# Altium schematic sheet Audio.SchDoc
size A4; Revision: B.2(PCB.SCH)
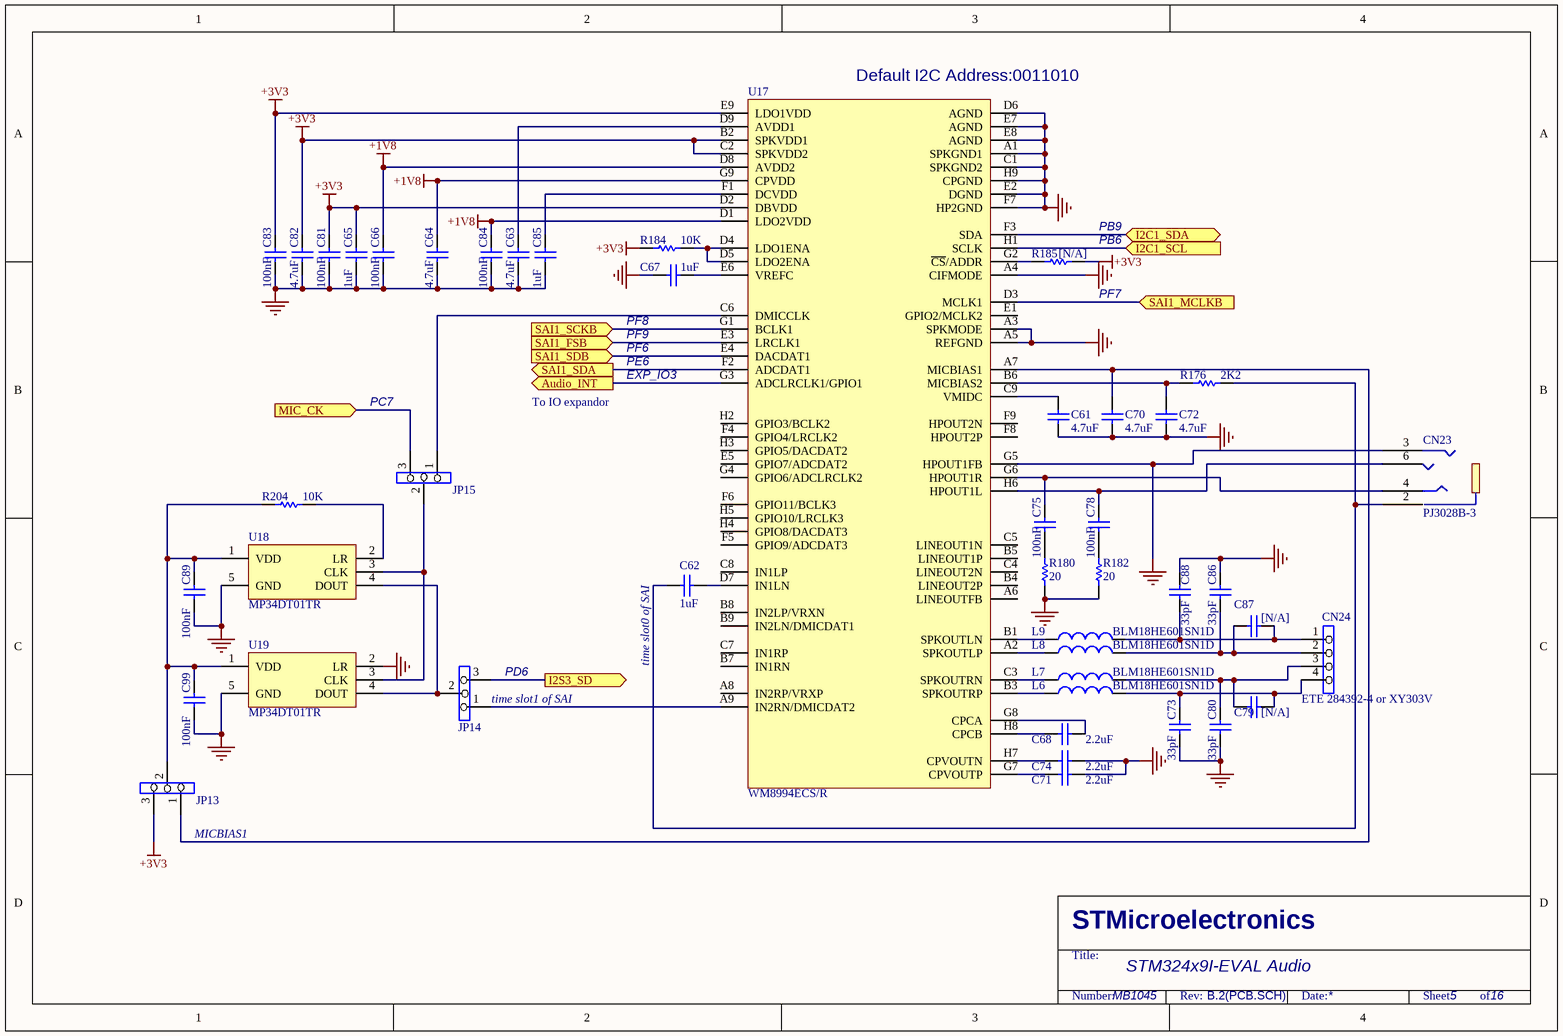
[diagram p0: Audio.SchDoc]

## Parts
C61  4.7uF  [0603C]
C62  1uF  [0603C]
C63  4.7uF  [0603C]
C64  4.7uF  [0603C]
C65  1uF  [0603C]
C66  100nF  [0603C]
C67  1uF  [0603C]
C68  2.2uF  [0603C]
C70  4.7uF  [0603C]
C71  2.2uF  [0603C]
C72  4.7uF  [0603C]
C73  33pF  [0603C]
C74  2.2uF  [0603C]
C75  100nF  [0603C]
C78  100nF  [0603C]
C79  [N/A]  [0603C]
C80  33pF  [0603C]
C81  100nF  [0603C]
C82  4.7uF  [0603C]
C83  100nF  [0603C]
C84  100nF  [0603C]
C85  1uF  [0603C]
C86  33pF  [0603C]
C87  [N/A]  [0603C]
C88  33pF  [0603C]
C89  100nF  [0603C]
C99  100nF  [0603C]
CN23  PJ3028B-3  [PJ3028B]
CN24  ETE 284392-4 or XY303V  [BUCHANAN_284392-4]
JP13  (no value)  [SIP3]
JP14  (no value)  [SIP3]
JP15  (no value)  [SIP3]
L6  BLM18HE601SN1D  [0603L]
L7  BLM18HE601SN1D  [0603L]
L8  BLM18HE601SN1D  [0603L]
L9  BLM18HE601SN1D  [0603L]
R176  2K2  [0603R]
R180  20  [0603R]
R182  20  [0603R]
R184  10K  [0603R]
R185  [N/A]  [0603R]
R204  10K  [0603R]
U17  WM8994ECS/R  [BGA72_0R5_4R5X4]
U18  MP34DT01TR  [MP34DT01TR]
U19  MP34DT01TR  [MP34DT01TR]

## Ports
Audio_INT (out), I2C1_SCL (in), I2C1_SDA (bidir), I2S3_SD (out), MIC_CK (in), SAI1_FSB (in), SAI1_MCLKB (in), SAI1_SCKB (in), SAI1_SDA (out), SAI1_SDB (in)

## Nets
+1V8: C64.1 C66.1 C84.1 U17.D1(LDO2VDD) U17.D8(AVDD2) U17.G9(CPVDD)
+3V3: C65.1 C81.1 C82.1 C83.1 JP13.3 R184.2 R185.1 U17.B2(SPKVDD1) U17.C2(SPKVDD2) U17.D2(DBVDD) U17.E9(LDO1VDD)
GND: C61.1 C63.2 C64.2 C65.2 C66.2 C67.2 C70.1 C71.2 C72.1 C73.2 C74.2 C80.2 C81.2 C82.2 C83.2 C84.2 C85.2 C86.1 C88.1 C89.2 C99.2 CN23.3 R180.2 R182.2 U17.A1(SPKGND1) U17.A3(SPKMODE) U17.A4(CIFMODE) U17.A5(REFGND) U17.C1(SPKGND2) U17.D6(AGND) U17.E2(DGND) U17.E7(AGND) U17.E8(AGND) U17.F7(HP2GND) U17.G5(HPOUT1FB) U17.H9(CPGND) U18.5(GND) U19.2(LR) U19.5(GND)
Audio_INT: U17.G3(ADCLRCLK1/GPIO1) ; port Audio_INT
I2C1_SCL: U17.H1(SCLK) ; port I2C1_SCL
I2C1_SDA: U17.F3(SDA) ; port I2C1_SDA
I2S3_SD: JP14.3 ; port I2S3_SD
MIC_CK: JP15.3 ; port MIC_CK
SAI1_FSB: U17.E3(LRCLK1) ; port SAI1_FSB
SAI1_MCLKB: U17.D3(MCLK1) ; port SAI1_MCLKB
SAI1_SCKB: U17.G1(BCLK1) ; port SAI1_SCKB
SAI1_SDA: U17.F2(ADCDAT1) ; port SAI1_SDA
SAI1_SDB: U17.E4(DACDAT1) ; port SAI1_SDB
NetC61_2: C61.2 U17.C9(VMIDC)
NetC62_1: C62.1 U17.D7(IN1LN)
NetC62_2: C62.2 CN23.2 R176.1
NetC63_1: C63.1 U17.D9(AVDD1)
NetC67_1: C67.1 U17.E6(VREFC)
NetC68_1: C68.1 U17.H8(CPCB)
NetC68_2: C68.2 U17.G8(CPCA)
NetC70_2: C70.2 JP13.1 U17.A7(MICBIAS1)
NetC71_1: C71.1 U17.G7(CPVOUTP)
NetC72_2: C72.2 R176.2 U17.B6(MICBIAS2)
NetC73_1: C73.1 C79.2 CN24.4 L6.2
NetC74_1: C74.1 U17.H7(CPVOUTN)
NetC75_1: C75.1 CN23.4 U17.G6(HPOUT1R)
NetC75_2: C75.2 R180.1
NetC78_1: C78.1 CN23.6 U17.H6(HPOUT1L)
NetC78_2: C78.2 R182.1
NetC79_1: C79.1 C80.1 CN24.3 L7.2
NetC85_1: C85.1 U17.F1(DCVDD)
NetC86_2: C86.2 C87.1 CN24.2 L8.2
NetC87_2: C87.2 C88.2 CN24.1 L9.2
NetC89_1: C89.1 C99.1 JP13.2 R204.2 U18.1(VDD) U19.1(VDD)
NetJP14_1: JP14.1 U17.A9(IN2RN/DMICDAT2)
NetJP14_2: JP14.2 U18.4(DOUT) U19.4(DOUT)
NetJP15_1: JP15.1 U17.C6(DMICCLK)
NetJP15_2: JP15.2 U18.3(CLK) U19.3(CLK)
NetL6_1: L6.1 U17.B3(SPKOUTRP)
NetL7_1: L7.1 U17.C3(SPKOUTRN)
NetL8_1: L8.1 U17.A2(SPKOUTLP)
NetL9_1: L9.1 U17.B1(SPKOUTLN)
NetR184_1: R184.1 U17.D4(LDO1ENA) U17.D5(LDO2ENA)
NetR185_2: R185.2 U17.G2(~{CS}/ADDR)
NetR204_1: R204.1 U18.2(LR)

Not connected (* = marked no-connect by the designer): U17 A6(LINEOUTFB) A8(IN2RP/VRXP) B4(LINEOUT2P) B5(LINEOUT1P) B7(IN1RN) B8(IN2LP/VRXN) B9(IN2LN/DMICDAT1) C4(LINEOUT2N) C5(LINEOUT1N) C7(IN1RP) C8(IN1LP) E1(GPIO2/MCLK2) E5(GPIO7/ADCDAT2) F4(GPIO4/LRCLK2) F5(GPIO9/ADCDAT3) F6(GPIO11/BCLK3) F8(HPOUT2P) F9(HPOUT2N) G4(GPIO6/ADCLRCLK2) H2(GPIO3/BCLK2) H3(GPIO5/DACDAT2) H4(GPIO8/DACDAT3) H5(GPIO10/LRCLK3)

## Notes on the sheet
- (near U17) Default I2C Address:0011010
- (near R185) PB9
- (near R185) PB6
- (near R185) PF7
- PF6
- PF8
- PF9
- PE6
- EXP_IO3
- PC7
- To IO expandor
- (near JP14) time slot1 of SAI
- (near JP14) PD6
- (near C62) time slot0 of SAI
- (near JP13) MICBIAS1
- STM324x9I-EVAL Audio
- MB1045
- 5
- 16
- STMicroelectronics
- Title:
- Number:
- Rev:
- Date:
- Sheet          of

## Library data of the parts
C61 C63 C64 C66 C70 C72 C73 C75 C78-C84 C86-C89 C99 = Cap: Capacitor; Value: 10nF; Published: 8-Jun-2000; Revision: July-2002: Re-released for DXP Platform.; Publisher: Altium Limited
C62 C65 C67 C68 C71 C74 C85 = CAP: Capacitor; Value: 100nF; Published: 8-Jun-2000; Revision: July-2002: Re-released for DXP Platform.; Publisher: Altium Limited
CN24 = ETE 284392-4 or XY303V: ETE 284392-4
JP13-JP15 = Jumper3
L6-L9 = Inductor: Value: 100uH; Published: 8-Jun-2000; Revision: July-2002: Re-released for DXP Platform.; Publisher: Altium Limited
R176 R180 R182 R184 R185 R204 = Res1: Resistor; Value: 1K; Published: 8-Jun-2000; Revision: July-2002: Re-released for DXP Platform.; Publisher: Altium Limited
U18 U19 = MP34DT01TR: MEMS audio sensor; Revision: 17-Jul-2002: Re-released for DXP Platform.; Publisher: Altium Limited